# EAGLE design untitled (EAGLE 9.2.2)
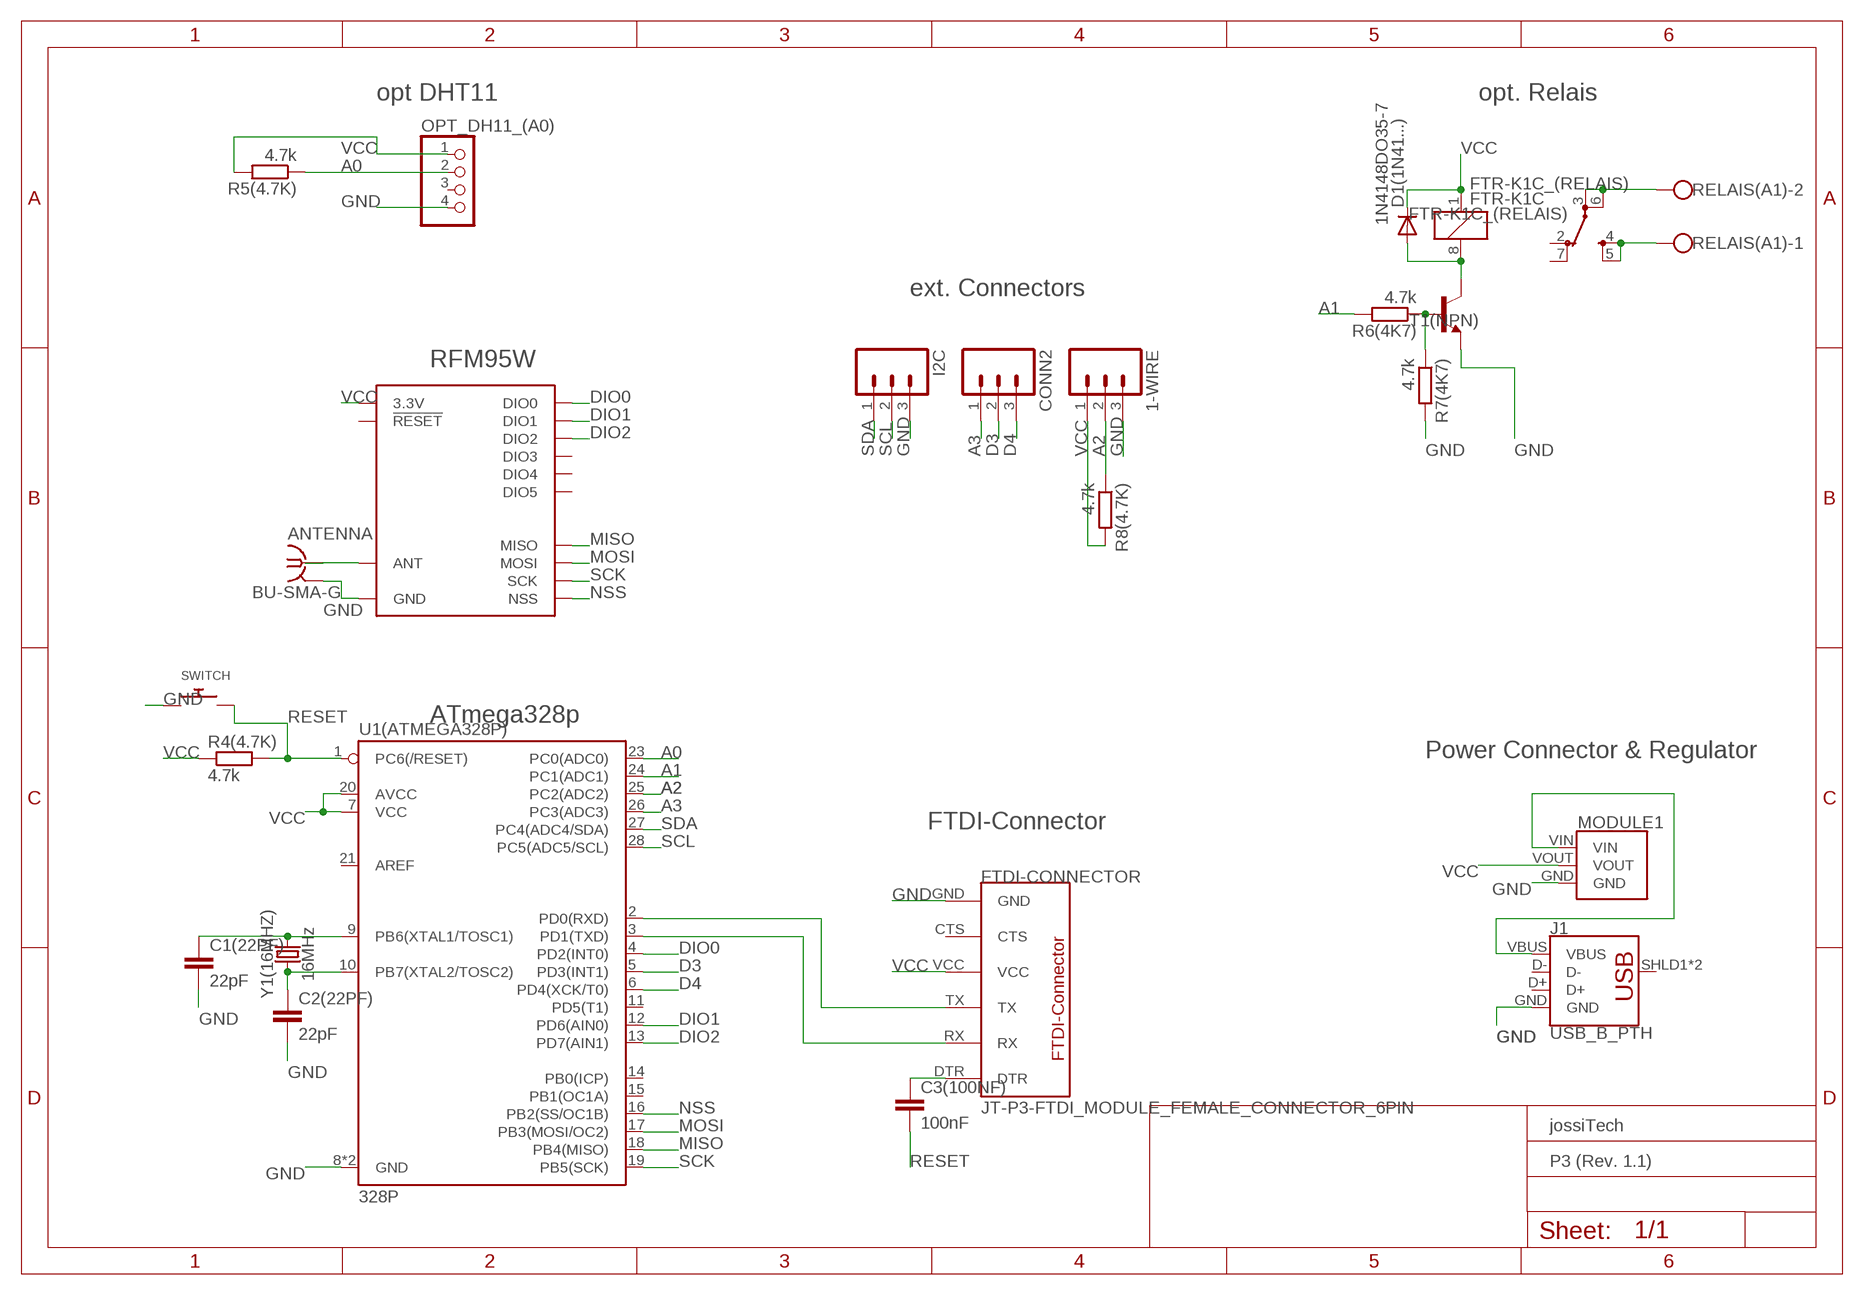
[diagram p0: schematic, sheet 1]
FRAME1 (A4L-LOC): COMPANY: jossiTech; PRODUCT: P3 (Rev. 1.1)

## Parts
1-WIRE  M03  [03P]
ANTENNA  BU-SMA-G  [BU-SMA-G]
C1(22PF)  22pF  22PF-PTH-2.54MM-200V-5%  [CAP-PTH-2.54]
C2(22PF)  22pF  22PF-PTH-2.54MM-200V-5%  [CAP-PTH-2.54]
C3(100NF)  100nF  22PF-PTH-2.54MM-200V-5%  [CAP-PTH-2.54]
CONN2  M03  [03P]
D1(1N41...)  1N4148DO35-7  [DO35-7]
FTDI-CONNECTOR  JT-P3-FTDI_MODULE_FEMALE_CONNECTOR_6PIN  [JT-P3-FTDI_MODULE_FEMALE_CONNECTOR_6PIN]
FTR-K1C_(RELAIS)  FTR-K1C  [FTR-K1C]
I2C  M03  [03P]
J1  USB_B_PTH  [USB-B-PTH]
MODULE1  JT-P3-VOLTAGEREGULATOR  [JT-P3-VOLTAGEREGULATOR]
OPT_DH11_(A0)  PINHD-1X4  [1X04]
R4(4.7K)  4.7k  R0207/10  [0207/10]
R5(4.7K)  4.7k  R0207/10  [0207/10]
R6(4K7)  4.7k  R0207/10  [0207/10]
R7(4K7)  4.7k  R0207/10  [0207/10]
R8(4.7K)  4.7k  R0207/10  [0207/10]
RELAIS(A1)  W237-102  [W237-102]
SWITCH  SWITCH_PUSHBUTTONEVQ-PE  [TACT_PANA-EVQ]
T1(NPN)  BC237-NPN-TO92-CBE  [TO92-CBE]
U1(ATMEGA328P)  328P  ATMEGA328P_PDIP  [DIP28]
U2  RFM95W  [RFM95/96/97/98W]
Y1(16MHZ)  16MHz  CRYSTAL-16MHZPTH-HC49US  [HC49US]

## Nets
A0: OPT_DH11_(A0).2 R5(4.7K).1 U1(ATMEGA328P).23(PC0(ADC0))
A1: R6(4K7).2 U1(ATMEGA328P).24(PC1(ADC1))
A2: 1-WIRE.2 R8(4.7K).1 U1(ATMEGA328P).25(PC2(ADC2))
A3: CONN2.1 U1(ATMEGA328P).26(PC3(ADC3))
D3: CONN2.2 U1(ATMEGA328P).5(PD3(INT1))
D4: CONN2.3 U1(ATMEGA328P).6(PD4(XCK/T0))
DIO0: U1(ATMEGA328P).4(PD2(INT0)) U2.DIO0
DIO1: U1(ATMEGA328P).12(PD6(AIN0)) U2.DIO1
DIO2: U1(ATMEGA328P).13(PD7(AIN1)) U2.DIO2
GND: 1-WIRE.3 ANTENNA.2 ANTENNA.3 ANTENNA.4 ANTENNA.5 C1(22PF).2 C2(22PF).2 FTDI-CONNECTOR.GND I2C.3 J1.GND MODULE1.GND OPT_DH11_(A0).4 R7(4K7).2 SWITCH.P$1 T1(NPN).E U1(ATMEGA328P).8(GND) U1(ATMEGA328P).22(GND) U2.GND@1(GND) U2.GND@2(GND) U2.GND@3(GND)
MISO: U1(ATMEGA328P).18(PB4(MISO)) U2.MISO
MOSI: U1(ATMEGA328P).17(PB3(MOSI/OC2)) U2.MOSI
N$1: ANTENNA.1 U2.ANT
N$2: J1.VBUS MODULE1.VIN
N$3: FTDI-CONNECTOR.TX U1(ATMEGA328P).2(PD0(RXD))
N$4: C1(22PF).1 U1(ATMEGA328P).9(PB6(XTAL1/TOSC1)) Y1(16MHZ).2
N$5: FTDI-CONNECTOR.RX U1(ATMEGA328P).3(PD1(TXD))
N$6: C3(100NF).1 FTDI-CONNECTOR.DTR
N$7: C2(22PF).1 U1(ATMEGA328P).10(PB7(XTAL2/TOSC2)) Y1(16MHZ).1
N$8: D1(1N41...).A FTR-K1C_(RELAIS).8 T1(NPN).C
N$9: R6(4K7).1 R7(4K7).1 T1(NPN).B
N$10: FTR-K1C_(RELAIS).4(-1:SA) FTR-K1C_(RELAIS).5(-1:SB) RELAIS(A1).1
N$11: FTR-K1C_(RELAIS).3(-1:PA) FTR-K1C_(RELAIS).6(-1:PB) RELAIS(A1).2
NSS: U1(ATMEGA328P).16(PB2(SS/OC1B)) U2.NSS
RESET: C3(100NF).2 R4(4.7K).2 SWITCH.P$2 U1(ATMEGA328P).1(PC6(/RESET))
SCK: U1(ATMEGA328P).19(PB5(SCK)) U2.SCK
SCL: I2C.2 U1(ATMEGA328P).28(PC5(ADC5/SCL))
SDA: I2C.1 U1(ATMEGA328P).27(PC4(ADC4/SDA))
VCC: 1-WIRE.1 D1(1N41...).C FTDI-CONNECTOR.VCC FTR-K1C_(RELAIS).1 MODULE1.VOUT OPT_DH11_(A0).1 R4(4.7K).1 R5(4.7K).2 R8(4.7K).2 U1(ATMEGA328P).7(VCC) U1(ATMEGA328P).20(AVCC) U2.3.3V
Unconnected: FTDI-CONNECTOR.CTS FTR-K1C_(RELAIS).2(-1:OA) FTR-K1C_(RELAIS).7(-1:OB) J1.D+ J1.D- J1.SHLD1(SHIELD) J1.SHLD2(SHIELD) OPT_DH11_(A0).3 U1(ATMEGA328P).11(PD5(T1)) U1(ATMEGA328P).14(PB0(ICP)) U1(ATMEGA328P).15(PB1(OC1A)) U1(ATMEGA328P).21(AREF) U2.!RESET U2.DIO3 U2.DIO4 U2.DIO5

## Notes on the sheet
- opt DHT11 | opt. Relais
- ext. Connectors
- RFM95W
- ATmega328p
- Power Connector & Regulator
- FTDI-Connector

## Library data of the parts
1-WIRE CONN2 I2C = con-amp-quick:M03: AMP QUICK CONNECTOR; OC_FARNELL: unknown; OC_NEWARK: unknown
ANTENNA = con-coax:BU-SMA-G: FEMALE SMA CONNECTOR Radiall distributor RS 193-9117; OC_FARNELL: unknown; OC_NEWARK: unknown
C1(22PF) C2(22PF) = SparkFun-Capacitors:22PF: 22pF ceramic capacitors A capacitor is a passive two-terminal electrical component used to store electrical energy temporarily in an electric field.; PROD_ID: CAP-09128
C3(100NF) = SparkFun-Capacitors:22PF: 22pF ceramic capacitors A capacitor is a passive two-terminal electrical component used to store electrical energy temporarily in an electric field.; PROD_ID: CAP-09128; VALUE: 22pF
D1(1N41...) = diode:1N4148: DIODE high speed (Philips)
FTDI-CONNECTOR = JT-P3-FTDI_MODULE_FEMALE_CONNECTOR_6PIN:JT-P3-FTDI_MODULE_FEMALE_CONNECTOR_6PIN: FTDI_MODULE_FEMALE_CONNECTOR_6PIN
FTR-K1C_(RELAIS) = relay:FTR-K1C: NETZRELAIS FTR-K1CK024W1XUM 16A/250VAC 1 Umschaltkontakt Distributor: Conrad Electronic Bestell Nr.: 504389-13 - 24V Source: http://www.produktinfo.conrad.com/datenblaetter/500000-524999/504384-da-01-de-NETZRELAIS_FTR_K1CK012W1XUM_16A_250VAC.pdf; OC_FARNELL: unknown; OC_NEWARK: unknown
J1 = SparkFun-Connectors:USB_B: USB Type B Connector SparkFun Products: SparkFun Stepoko <https://www.sparkfun.com/products/13899> PTH; PROD_ID: CONN-08278; SF_ID: PRT-00139
MODULE1 = JT-P3-VoltageRegulator:JT-P3-VOLTAGEREGULATOR: Voltage Regulator from Aliexpress VIN=4.75V - 12V VOUT=3.3V Max Current 800mA
OPT_DH11_(A0) = pinhead:PINHD-1X4: PIN HEADER
R4(4.7K) R5(4.7K) R6(4K7) R7(4K7) R8(4.7K) = eagle-ltspice:R: RESISTOR, European symbol; SPICEMODEL: NONE; SPICEPREFIX: R
RELAIS(A1) = con-wago-500:W237-102: WAGO SCREW CLAMP; MPN: 237-102; OC_FARNELL: unknown; OC_NEWARK: 70K9898
SWITCH = adafruit:SWITCH_PUSHBUTTON: Buttons SOFTTOUCHSMD_SJ - Soft touch temporary push button (Super Junk Akihabara) Compatible with SKPMANE010 [Mouser: 688-SKPMAN] C&K_KSS = Digikey: KSS221GLFS
T1(NPN) = transistor:*-NPN-: NPN Transistror BF959 corrected 2008.03.06
U1(ATMEGA328P) = SparkFun-IC-Microcontroller:ATMEGA328P_PDIP: Atmel 328P Through hole ATMEGA328P uC used in the Arduino 32kb flash, 1k EEPROM, 2k SRAM Datasheet <http://www.sparkfun.com/datasheets/Components/SMD/ATMega328.pdf> SparkFun Products Storefront component: AVR 28 Pin 20MHz 32K 6A/D - ATMega328P <https://www.sparkfun.com/products/9061> (COM-09061) SparkFun Simon Says - Through-Hole Soldering Kit <https://www.sparkfun.com/products/10547> (KIT-10547) SparkFun Learn to Solder - Simon Says <https://www.sparkfun.com/products/13708> (KIT-13708) SparkFun BigTime Watch Kit <https://www.sparkfun.com/products/11734> (KIT-11734) SparkFun ClockIt <https://www.sparkfun.com/products/10930> (KIT-10930) SparkFun Serial Enabled LCD Kit <https://www.sparkfun.com/products/10097> (LCD-10097) SparkFun Simon Tilts - Through Hole Soldering Kit <https://www.sparkfun.com/products/12634> (KIT-12634) SparkFun Frequency Counter Kit <https://www.sparkfun.com/products/10140> (KIT-10140) FabFM Radio Kit <https://www.sparkfun.com/products/11043> (KIT-11043) SparkFun Binary Blaster Kit <https://www.sparkfun.com/products/12037> (KIT-12037) SparkFun Metro-Gnome <https://www.sparkfun.com/products/9236> (KIT-09236) ATmega328 with Arduino Optiboot (Uno) <https://www.sparkfun.com/products/10524> (DEV-10524); PROD_ID: IC-09136
U2 = SparkFun-RF:RFM95W: RFM95/96/97/98 The RFM95/96/97/98(W) transceivers feature the LoRaTM long range modem that provides ultra-long range spread spectrum communication and high interference immunity whilst minimising current consumption. These devices also support high performance (G)FSK modes for systems including WMBus, IEEE802.15.4g. The RFM95/96/97/98(W) deliver exceptional phase noise, selectivity, receiver linearity and IIP3 for significantly lower current consumption than competing devices Datasheet <http://www.hoperf.com/upload/rf/RFM95_96_97_98W.pdf>; PROD_ID: IC-13959
Y1(16MHZ) = SparkFun-Clocks:CRYSTAL-16MHZ: 16MHz Crystal Digikey Example <http://www.digikey.com/product-search/en?keywords=535-9122-1-ND> Frequency: 16MHz Frequency Stability: ±50ppm Frequency Tolerance: ±20ppm Load Capacitance: 18pF SparkFun Products: Pro Micro -5V/16MHz <https://www.sparkfun.com/products/12640> SparkFun Serial Enabled LCD Kit <https://www.sparkfun.com/products/10097>; PROD_ID: XTAL-08181; SF_ID: COM-00536

## Board
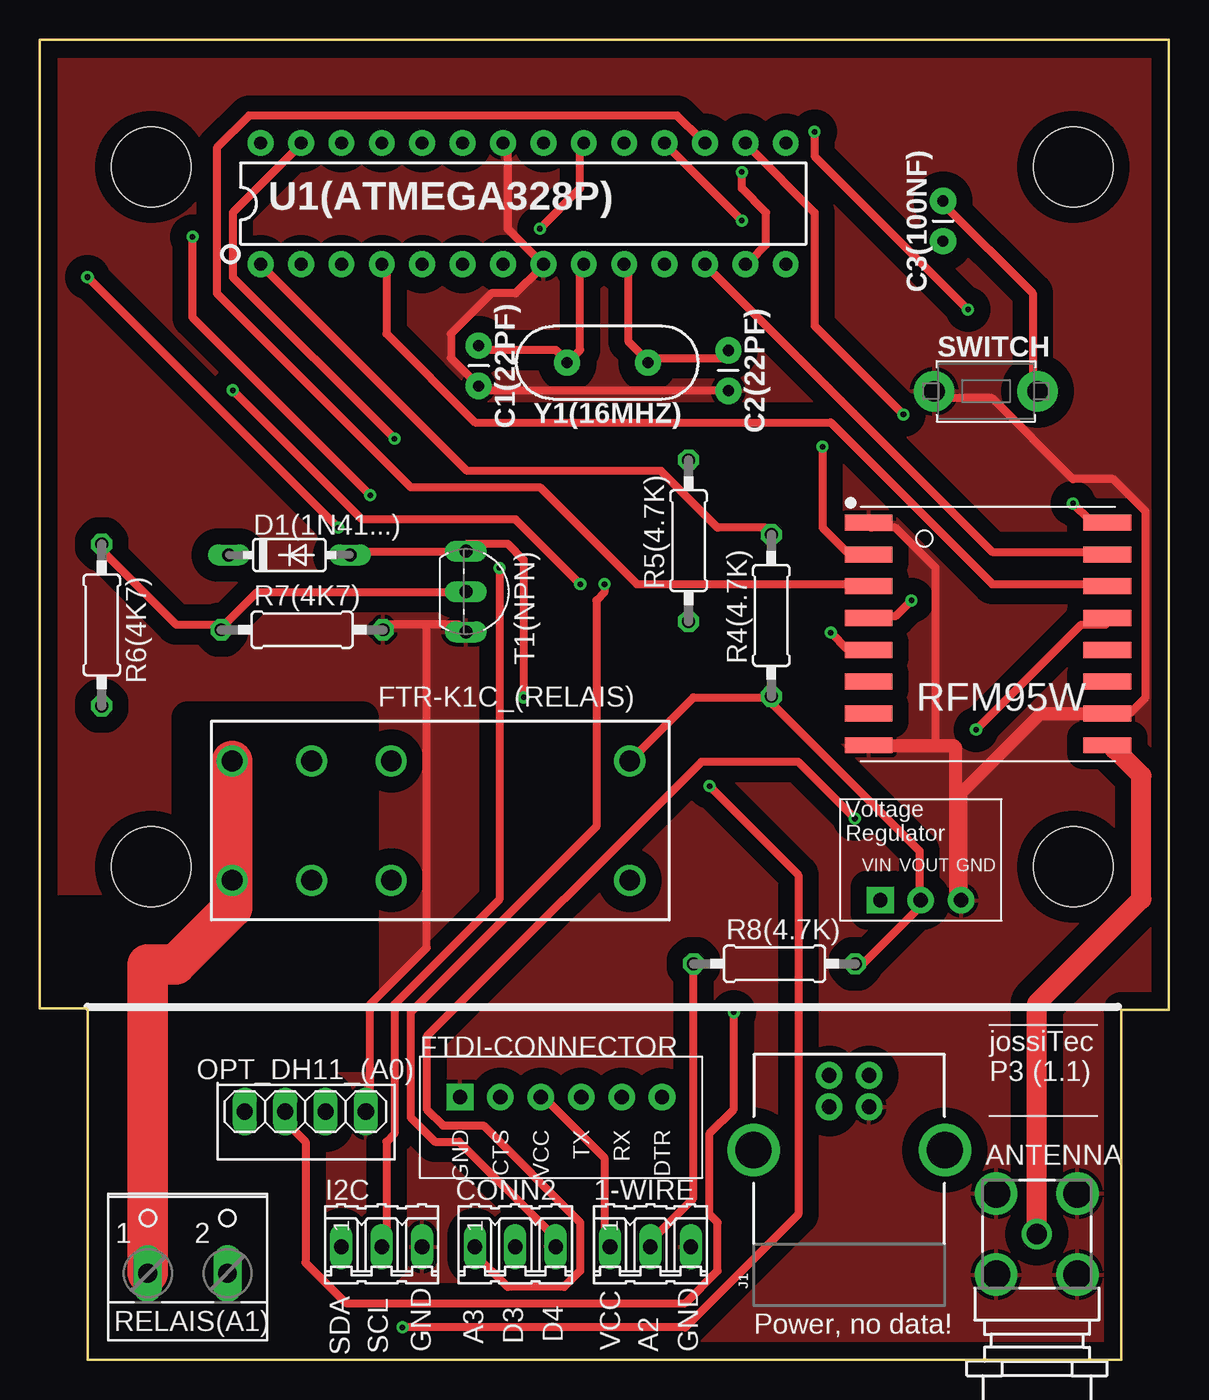
[diagram p1: board, top side]
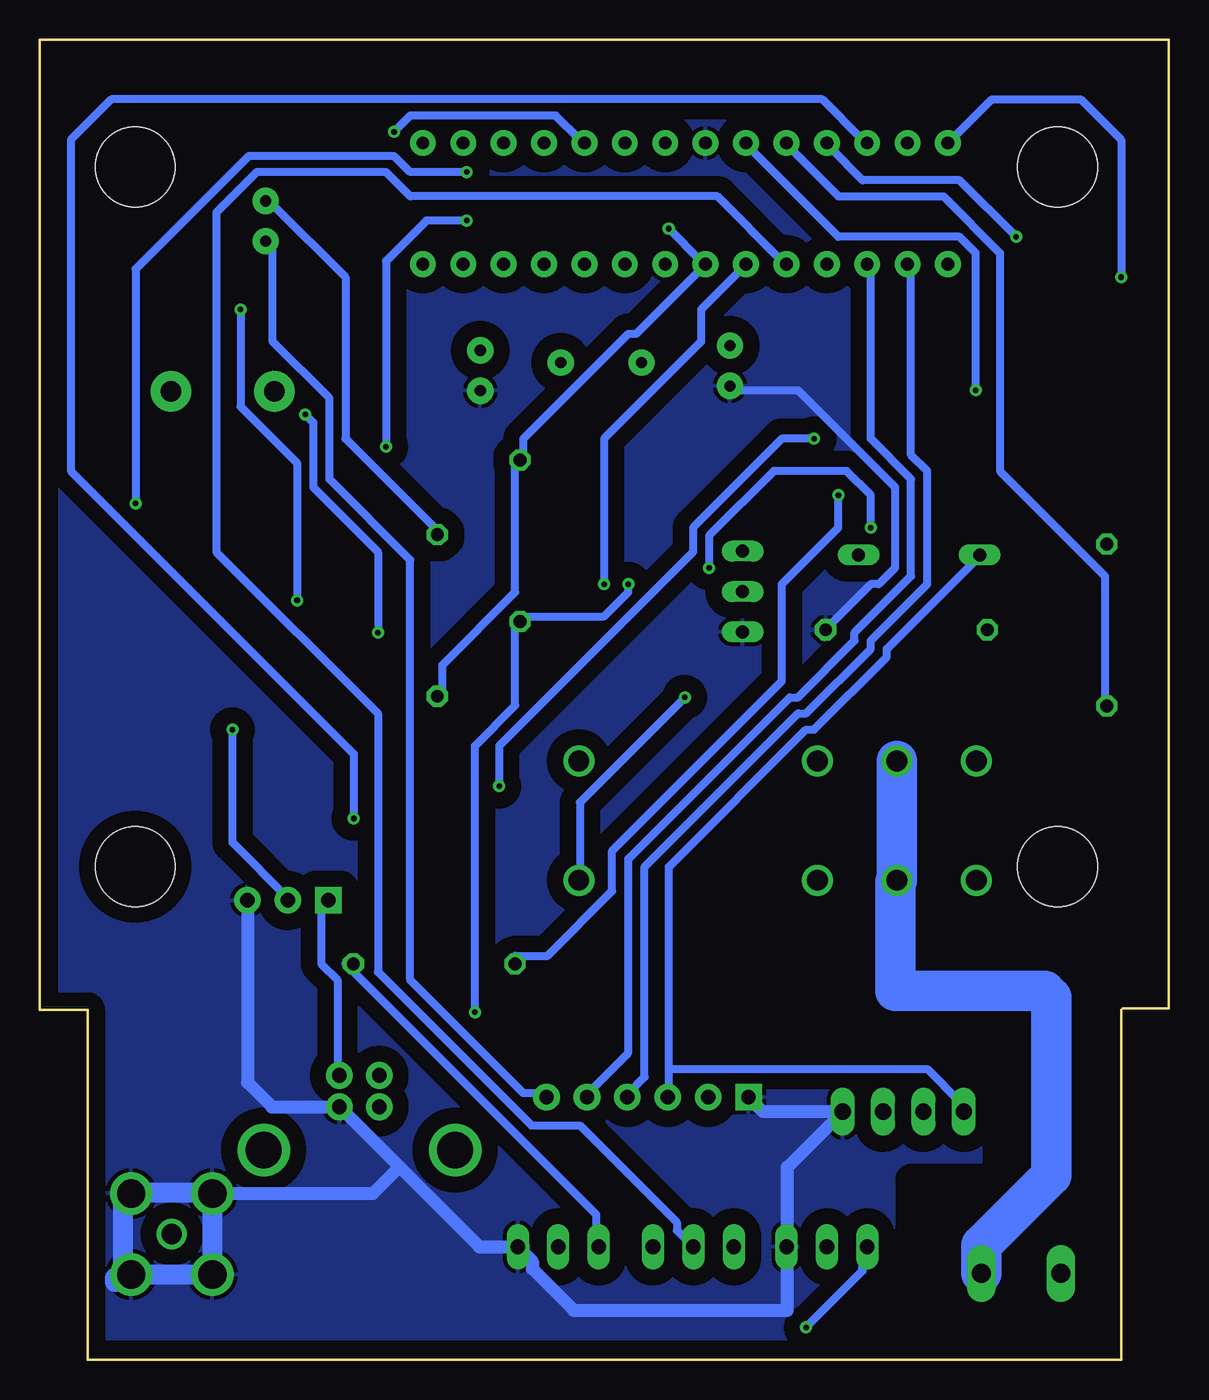
[diagram p2: board, bottom side, seen from below]

Size 71 x 83 mm. Coordinates in mm from the lower left corner, seen from the top.
Outline: 3,0 3,22 2.9,22.1 0,22.1 0,83 71,83 71,22 68,22 68,0 3,0
Copper layers (1*16): Top 0.035mm / dielectric 1.5mm / Bottom 0.035mm
Design rules "default *": minimum track width 20mil, minimum drill 0.35mm, track to track 20mil, track to pad 20mil, pad to pad 20mil, via to via 20mil, smd to smd 20mil, copper to edge 40mil, drill to drill 20mil, minimum pad ring 10mil, minimum via ring 8mil, stop-mask expansion 4mil, vias tented up to drill 0mil, thermal gap 10mil
Holes 5 mm at 7,31 65,31 7,75 65,75
tKeepout: area 9.5,23.1 to 20.2,40.3; area -1.6,19.3 to 20.2,28; area 1.7,2.9 to 10.4,21.8; area -0.5,0.3 to 16.5,11.3
bKeepout: area 9.5,19.4 to 20.2,40.2; area -1.4,19.4 to 20.1,28.1; area 2,2.3 to 10.4,21.5; area -0.2,0 to 15.8,11
tRestrict: area 9.3,19.1 to 20.3,40.4; area -1.7,19.3 to 20.3,28.2; area 1.8,2.7 to 10.7,21.5; area -0.5,0.1 to 16.2,11.1
bRestrict: area 9.5,19.4 to 20.3,40.6; area -1.2,19.1 to 20.4,28.2; area 2.2,2.2 to 10.7,21.4; area -0.6,0 to 16.2,11.3

### Footprints (pad centres in the part's own frame; a part is rotated, then mirrored left to right if it is on the bottom)
03P = drill 0.914 long: 1 -2.54,0; 2 0,0; 3 2.54,0
BU-SMA-G = drill 1.27: 1 0,0 | drill 1.778: 2 -2.55,2.55; 3 2.55,2.55; 4 2.55,-2.55; 5 -2.55,-2.55
CAP-PTH-2.54 = drill 0.7 pad 1.651: 1 -1.27,0; 2 1.27,0
DO35-7 = drill 0.813 long: A 3.81,0; C -3.81,0
JT-P3-FTDI_MODULE_FEMALE_CONNECTOR_6PIN = drill 0.9 pad 1.676: CTS -11.43,3.81; DTR -1.27,3.81; RX -3.81,3.81; TX -6.35,3.81; VCC -8.89,3.81 | drill 0.9 pad 1.676 square: GND -13.97,3.81
FTR-K1C = drill 1.3 pad 1.93: 1 -12.5,-3.75; 2 2.5,-3.75; 3 7.5,-3.75; 4 12.5,-3.75; 5 12.5,3.75; 6 7.5,3.75; 7 2.5,3.75; 8 -12.5,3.75
USB-B-PTH = drill 0.914 pad 1.676: D+ 4,1.25; D- 5.981,1.25; GND 4,-1.25; VBUS 5.981,-1.25 | drill 2.286: SHLD1 1.282,-6.02; SHLD2 1.282,6.02
JT-P3-VOLTAGEREGULATOR = drill 0.9 pad 1.676: GND 2.54,-3.81; VOUT 0,-3.81 | drill 0.9 pad 1.676 square: VIN -2.54,-3.81
1X04 = drill 1.016 long: 1 -3.81,0; 2 -1.27,0; 3 1.27,0; 4 3.81,0
0207/10 = drill 0.813 octagon: 1 -5.08,0; 2 5.08,0
W237-102 = drill 1.194 long: 1 -2.5,-1.27; 2 2.5,-1.27
TACT_PANA-EVQ = drill 1.3 pad 2.54: P$1 -3.25,0; P$2 3.25,0
TO92-CBE = drill 0.813 long: B 0,0; C -2.54,0; E 2.54,0
DIP28 = drill 0.813 pad 1.626: 1 -16.51,-3.81; 2 -13.97,-3.81; 3 -11.43,-3.81; 4 -8.89,-3.81; 5 -6.35,-3.81; 6 -3.81,-3.81; 7 -1.27,-3.81; 8 1.27,-3.81; 9 3.81,-3.81; 10 6.35,-3.81; 11 8.89,-3.81; 12 11.43,-3.81; 13 13.97,-3.81; 14 16.51,-3.81; 15 16.51,3.81; 16 13.97,3.81; 17 11.43,3.81; 18 8.89,3.81; 19 6.35,3.81; 20 3.81,3.81; 21 1.27,3.81; 22 -1.27,3.81; 23 -3.81,3.81; 24 -6.35,3.81; 25 -8.89,3.81; 26 -11.43,3.81; 27 -13.97,3.81; 28 -16.51,3.81
RFM95/96/97/98W = smd 3 x 1: 3.3V 7.5,1; !RESET -7.5,-3; ANT 7.5,-7; DIO0 7.5,3; DIO1 7.5,5; DIO2 7.5,7; DIO3 7.5,-3; DIO4 7.5,-1; DIO5 -7.5,-5; GND@1 -7.5,7; GND@2 -7.5,-7; GND@3 7.5,-5; MISO -7.5,5; MOSI -7.5,3; NSS -7.5,-1; SCK -7.5,1
HC49US = drill 0.7 pad 1.651: 1 -2.54,0; 2 2.54,0

### Placement (x,y rotation side)
1-WIRE  38.4,7.1 0 top
ANTENNA  62.7,7.9 270 top
C1(22PF)  27.6,62.5 270 top
C2(22PF)  43.3,62.2 270 top
C3(100NF)  56.8,71.6 90 top
CONN2  29.9,7.1 0 top
D1(1N41...)  15.7,50.6 0 top
FTDI-CONNECTOR  40.4,12.7 0 top
FTR-K1C_(RELAIS)  24.6,33.9 180 top
I2C  21.5,7.1 0 top
J1  50.9,11.9 90 top
MODULE1  55.4,32.7 0 top
OPT_DH11_(A0)  16.7,15.6 0 top
R4(4.7K)  46,46.8 90 top
R5(4.7K)  40.8,51.5 90 top
R6(4K7)  3.9,46.2 270 top
R7(4K7)  16.5,45.9 0 top
R8(4.7K)  46.2,24.9 0 top
RELAIS(A1)  9.3,6.7 0 top
SWITCH  59.5,60.9 0 top
T1(NPN)  26.8,48.3 270 top
U1(ATMEGA328P)  30.4,72.7 0 top
U2  59.63,45.64 0 top
Y1(16MHZ)  35.7,62.7 180 top

### Tracks (layer width: path | path; a pad name or v marks a point on that pad's centre or on a via)
A0  (via drill 0.35)
  Top 0.508: v43.64,21.84 43.64,15.75 42.12,14.22 42.12,9.14 42.62,8.64 42.62,5.59 40.59,3.56 19.26,3.56 16.72,6.1 16.72,13.72 15.19,15.24 OPT_DH11_(A0).2 | v12.14,60.96 20.27,52.83 29.92,52.83 v33.99,48.77
  Bottom 0.508: v43.64,21.84 43.64,38.61 41.1,41.15 41.1,46.23 R5(4.7K).1 40.59,46.74 35.51,46.74 33.99,48.26 v33.99,48.77 | v12.14,60.96 12.14,69.6 13.16,70.61 20.78,70.61 26.37,76.2 U1(ATMEGA328P).23
A1
  Bottom 0.508: R6(4K7).2 4.02,41.15 4.02,49.28 10.62,55.88 10.62,69.6 14.18,73.15 20.78,73.15 23.83,76.2 U1(ATMEGA328P).24
A2  (via drill 0.35)
  Top 0.508: R8(4.7K).1 41.1,24.89 41.1,10.16 38.05,7.11 1-WIRE.2 | v9.6,70.61 9.6,65.53 v20.78,54.36
  Bottom 0.508: v9.6,70.61 13.16,74.17 19.26,74.17 21.29,76.2 U1(ATMEGA328P).25 | v20.78,54.36 20.78,52.32 24.34,48.77 24.34,42.67 35,32 35,29.46 39.07,25.4 41.1,25.4 R8(4.7K).1
A3  (via drill 0.35)
  Top 0.508: v51.26,34.04 47.7,37.59 41.61,37.59 24.34,20.32 24.34,15.75 25.35,14.73 27.89,14.73 33.99,8.64 33.99,5.59 32.97,4.57 29.42,4.57 27.38,6.6 CONN2.1
  Bottom 0.508: v51.26,34.04 51.26,38.1 69.04,55.88 69.04,76.71 66.5,79.25 21.8,79.25 19.26,76.71 U1(ATMEGA328P).26
D3
  Bottom 0.508: CONN2.2 29.92,7.11 30.94,8.13 30.94,8.64 37.04,14.73 40.08,14.73 49.74,24.38 49.74,40.64 59.9,50.8 59.9,72.14 57.36,74.68 49.23,74.68 47.7,73.15 28.4,73.15 24.34,69.09 U1(ATMEGA328P).5
D4  (via drill 0.35)
  Top 0.508: v35.51,48.77 35.51,48.26 35,47.75 35,33.53 23.32,21.84 23.32,15.24 24.84,13.72 26.37,13.72 31.96,8.13 31.96,7.11 CONN2.3
  Bottom 0.508: v35.51,48.77 35.51,57.91 29.42,64.01 29.42,66.04 26.88,68.58 U1(ATMEGA328P).6
DIO0
  Top 0.508: U2.DIO0 67.01,48.77 59.9,48.77 49.74,58.93 27.38,58.93 21.8,64.52 21.8,68.58 U1(ATMEGA328P).4
DIO1
  Top 0.508: U2.DIO1 67.01,50.8 59.9,50.8 42.12,68.58 U1(ATMEGA328P).12
DIO2  (via drill 0.35)
  Top 0.508: v64.98,53.85 65.99,52.83 67.01,52.83 U2.DIO2 | v44.15,74.68 44.15,73.66 45.67,72.14 45.67,70.1 44.66,69.09 U1(ATMEGA328P).13
  Bottom 0.508: v64.98,53.85 64.98,68.58 57.86,75.69 48.72,75.69 47.7,74.68 v44.15,74.68
GND
  Top 0.508: 24.34,46.23 26.37,46.23 T1(NPN).E | 24.34,46.23 21.8,46.23 R7(4K7).2 | U1(ATMEGA328P).22 29.42,76.2 29.42,71.12 31.45,69.09 U1(ATMEGA328P).8 31.45,68.58 29.92,67.06 28.4,67.06 25.86,64.52 25.86,62.99 27.38,61.47 C1(22PF).2 27.89,60.96 43.13,60.96 C2(22PF).2 | U2.GND@2 52.28,38.61 52.78,38.61 53,38.6 | 56.34,38.6 56.34,49.78 53.8,52.32 52.28,52.32 U2.GND@1 | U2.GND@3 68.53,40.64 69.55,41.66 69.55,53.34 67.52,55.37 64.98,55.37 59.9,60.45 56.34,60.45 SWITCH.P$1 | 24.34,46.23 24.34,25.91 20.78,22.35 20.78,15.75 OPT_DH11_(A0).4
  Top 0.813: U2.GND@3 62.94,40.64 57.94,35.64 MODULE1.GND 57.6,29.23 57.6,38.5 57.5,38.6 56.34,38.6 53,38.6
  Bottom 0.508: R7(4K7).2 21.29,46.23 18.75,48.77 18.24,48.77 17.22,49.78 17.22,54.86 23.32,60.96 27.38,60.96 C1(22PF).2 | I2C.3 24.34,7.11 24,7.11 | 65.48,10.5 65.48,10.67 ANTENNA.2
  Bottom 0.813: MODULE1.GND 57.94,17.44 56.4,15.9 J1.GND 48.38,12.12 | 48.38,12.12 43.35,7.1 1-WIRE.3 40.03,6.19 40.03,5.71 37.41,3.1 24,3.1 24,7.11 24,12.11 OPT_DH11_(A0).4 25.52,15.6 FTDI-CONNECTOR.GND | ANTENNA.5 50.05,10.45 48.38,12.12
  Bottom 1.27: ANTENNA.3 65.8,5.9 65.8,10.5 65.48,10.5 60.2,10.5 ANTENNA.5 ANTENNA.4 66.05,5.35 66.27,5.13 66.27,4.9
  pour Top (isolate 1.016): 0.46,82.55 0.46,22.86 4.27,22.86 4.27,0 67.77,0 67.77,22.86 70.31,22.86 70.31,82.55
  pour Bottom (isolate 1.016): 0.46,82.55 0.46,22.86 4.27,22.86 4.27,1.27 67.77,1.27 67.77,22.86 70.31,22.86 70.31,82.55
MISO  (via drill 0.35)
  Top 0.508: v49.23,57.4 49.23,52.32 50.75,50.8 51.77,50.8 U2.MISO | v44.15,71.63 39.58,76.2 U1(ATMEGA328P).18
  Bottom 0.508: v49.23,57.4 49.23,69.09 46.69,71.63 v44.15,71.63
MOSI
  Top 0.508: U2.MOSI 51.77,48.77 37.54,48.77 31.45,54.86 23.32,54.86 11.13,67.06 11.13,76.2 13.16,78.23 40.08,78.23 41.61,76.71 U1(ATMEGA328P).17
N$1
  Top 0.508: U2.ANT 67.52,38.61 67.6,38.4
  Top 1.27: ANTENNA.1 62.7,22.4 69.27,28.97 69.27,36.73 67.6,38.4
N$2
  Bottom 0.508: J1.VBUS 52.28,18.29 52.28,23.88 53.29,24.89 53.29,28.45 MODULE1.VIN
N$3
  Bottom 0.508: U1(ATMEGA328P).2 16.21,68.58 16.21,56.9 15.19,55.88 15.19,48.77 18.75,45.21 18.75,44.7 22.81,40.64 23.32,40.64 32.97,30.99 32.97,17.78 33.99,16.76 FTDI-CONNECTOR.TX
N$4
  Top 0.508: U1(ATMEGA328P).9 33.99,68.58 33.99,63.5 33.48,62.99 Y1(16MHZ).2 32.97,62.99 32.46,63.5 27.89,63.5 C1(22PF).1
N$5
  Bottom 0.508: U1(ATMEGA328P).3 18.75,68.58 18.75,57.91 16.21,55.37 16.21,49.28 19.76,45.72 19.76,45.21 23.32,41.66 23.83,41.66 33.99,31.5 33.99,19.3 36.53,16.76 FTDI-CONNECTOR.RX
N$6
  Bottom 0.508: C3(100NF).1 56.34,70.1 56.34,64.01 52.78,60.45 52.78,55.37 47.7,50.29 47.7,23.88 40.59,16.76 39.58,16.76 FTDI-CONNECTOR.DTR
N$7
  Top 0.508: U1(ATMEGA328P).10 37.04,68.58 37.04,64.01 38.05,62.99 Y1(16MHZ).1 38.56,62.99 43.13,62.99 C2(22PF).1
N$8  (via drill 0.35)
  Top 0.508: D1(1N41...).A 19.76,50.8 26.37,50.8 T1(NPN).C 26.88,51.31 29.42,51.31 30.43,50.29 v30.43,41.66
  Bottom 0.508: v30.43,41.66 37.04,35.05 37.04,30.48 FTR-K1C_(RELAIS).8
N$9
  Top 0.508: R6(4K7).1 4.02,50.8 8.59,46.23 11.13,46.23 R7(4K7).1 11.64,46.23 13.67,48.26 26.37,48.26 T1(NPN).B
N$10
  Top 2.54: RELAIS(A1).1 6.8,24.85 8.55,24.85 12.1,28.4 FTR-K1C_(RELAIS).5 FTR-K1C_(RELAIS).4
N$11
  Bottom 2.54: RELAIS(A1).2 11.8,7.2 7.4,11.6 7.4,22.8 7.8,23.2 17.2,23.2 17.2,30.05 FTR-K1C_(RELAIS).6 FTR-K1C_(RELAIS).3
NSS  (via drill 0.35)
  Top 0.508: v49.74,45.72 50.75,44.7 51.77,44.7 U2.NSS | v54.31,59.44 48.72,65.02 48.72,72.14 44.66,76.2 U1(ATMEGA328P).16
  Bottom 0.508: v49.74,45.72 49.74,50.8 53.8,54.86 53.8,58.93 v54.31,59.44
RESET
  Top 0.508: U1(ATMEGA328P).1 14.18,68.58 26.88,55.88 39.07,55.88 42.62,52.32 45.67,52.32 R4(4.7K).2 | SWITCH.P$2 62.44,60.96 62.44,67.06 56.85,72.64 C3(100NF).2
  Bottom 0.508: R4(4.7K).2 46.18,52.32 51.77,57.91 51.77,68.07 56.34,72.64 C3(100NF).2
SCK  (via drill 0.35)
  Top 0.508: v54.82,47.75 53.8,46.74 52.28,46.74 U2.SCK | v58.37,66.04 48.72,75.69 v48.72,77.22
  Bottom 0.508: v54.82,47.75 54.82,56.39 58.37,59.94 v58.37,66.04 | v48.72,77.22 47.7,78.23 38.56,78.23 37.04,76.71 U1(ATMEGA328P).19
SCL  (via drill 0.35)
  Top 0.508: v28.91,49.78 28.91,28.96 22.3,22.35 22.3,14.22 21.8,13.72 21.8,7.11 I2C.2 | v3,68.07 v18.75,52.32
  Bottom 0.508: v28.91,49.78 28.91,51.82 24.84,55.88 20.27,55.88 18.75,54.36 v18.75,52.32 | v3,68.07 3,76.71 5.54,79.25 11.13,79.25 13.67,76.71 U1(ATMEGA328P).28
SDA  (via drill 0.35)
  Top 0.508: v22.81,2.03 40.59,2.03 47.7,9.14 47.7,30.48 v42.12,36.07 | v22.3,57.91 12.14,68.07 12.14,72.14 16.21,76.2 U1(ATMEGA328P).27
  Bottom 0.508: v22.81,2.03 19.26,5.59 19.26,6.6 I2C.1 | v42.12,36.07 42.12,38.61 29.92,50.8 29.92,52.32 24.34,57.91 v22.3,57.91
VCC  (via drill 0.35)
  Top 0.508: 1-WIRE.1 35.51,7.11 35.51,12.7 31.96,16.26 FTDI-CONNECTOR.VCC | R8(4.7K).2 51.77,24.89 55.32,28.45 MODULE1.VOUT 55.32,28.96 55.32,32 45.67,41.66 | v58.88,39.62 65.48,46.23 67.01,46.23 U2.3.3V | 45.67,41.66 41.1,41.66 37.54,38.1 FTR-K1C_(RELAIS).1 | v31.45,71.12 33.99,73.66 33.99,76.2 U1(ATMEGA328P).20 | 45.67,41.66 R4(4.7K).1
  Bottom 0.508: 31.45,18.29 31.45,16.76 FTDI-CONNECTOR.VCC | 31.45,18.29 31.45,30.99 22.81,39.62 22.3,39.62 17.73,44.2 17.73,44.7 12.14,50.29 D1(1N41...).C | 31.45,18.29 15.19,18.29 13.16,16.26 13.16,15.75 OPT_DH11_(A0).1 | v58.88,39.62 58.88,32.51 55.32,28.96 MODULE1.VOUT | R4(4.7K).1 45.67,42.16 45.67,43.69 41.1,48.26 41.1,56.39 R5(4.7K).2 40.59,56.9 40.59,57.91 33.99,64.52 33.48,64.52 29.42,68.58 U1(ATMEGA328P).7 29.42,69.09 v31.45,71.12 | 1-WIRE.1 36.02,7.11 36.02,9.14 51.77,24.89 R8(4.7K).2

### Text on the board
tPlace: RFM95W | _______ / jossiTec / P3 (1.1) / _______ | Power, no data! | A3 | D3 | D4 | VCC | SDA | SCL | GND | A2 | GND